# EAGLE design bt4.0_shield (EAGLE 6.1)
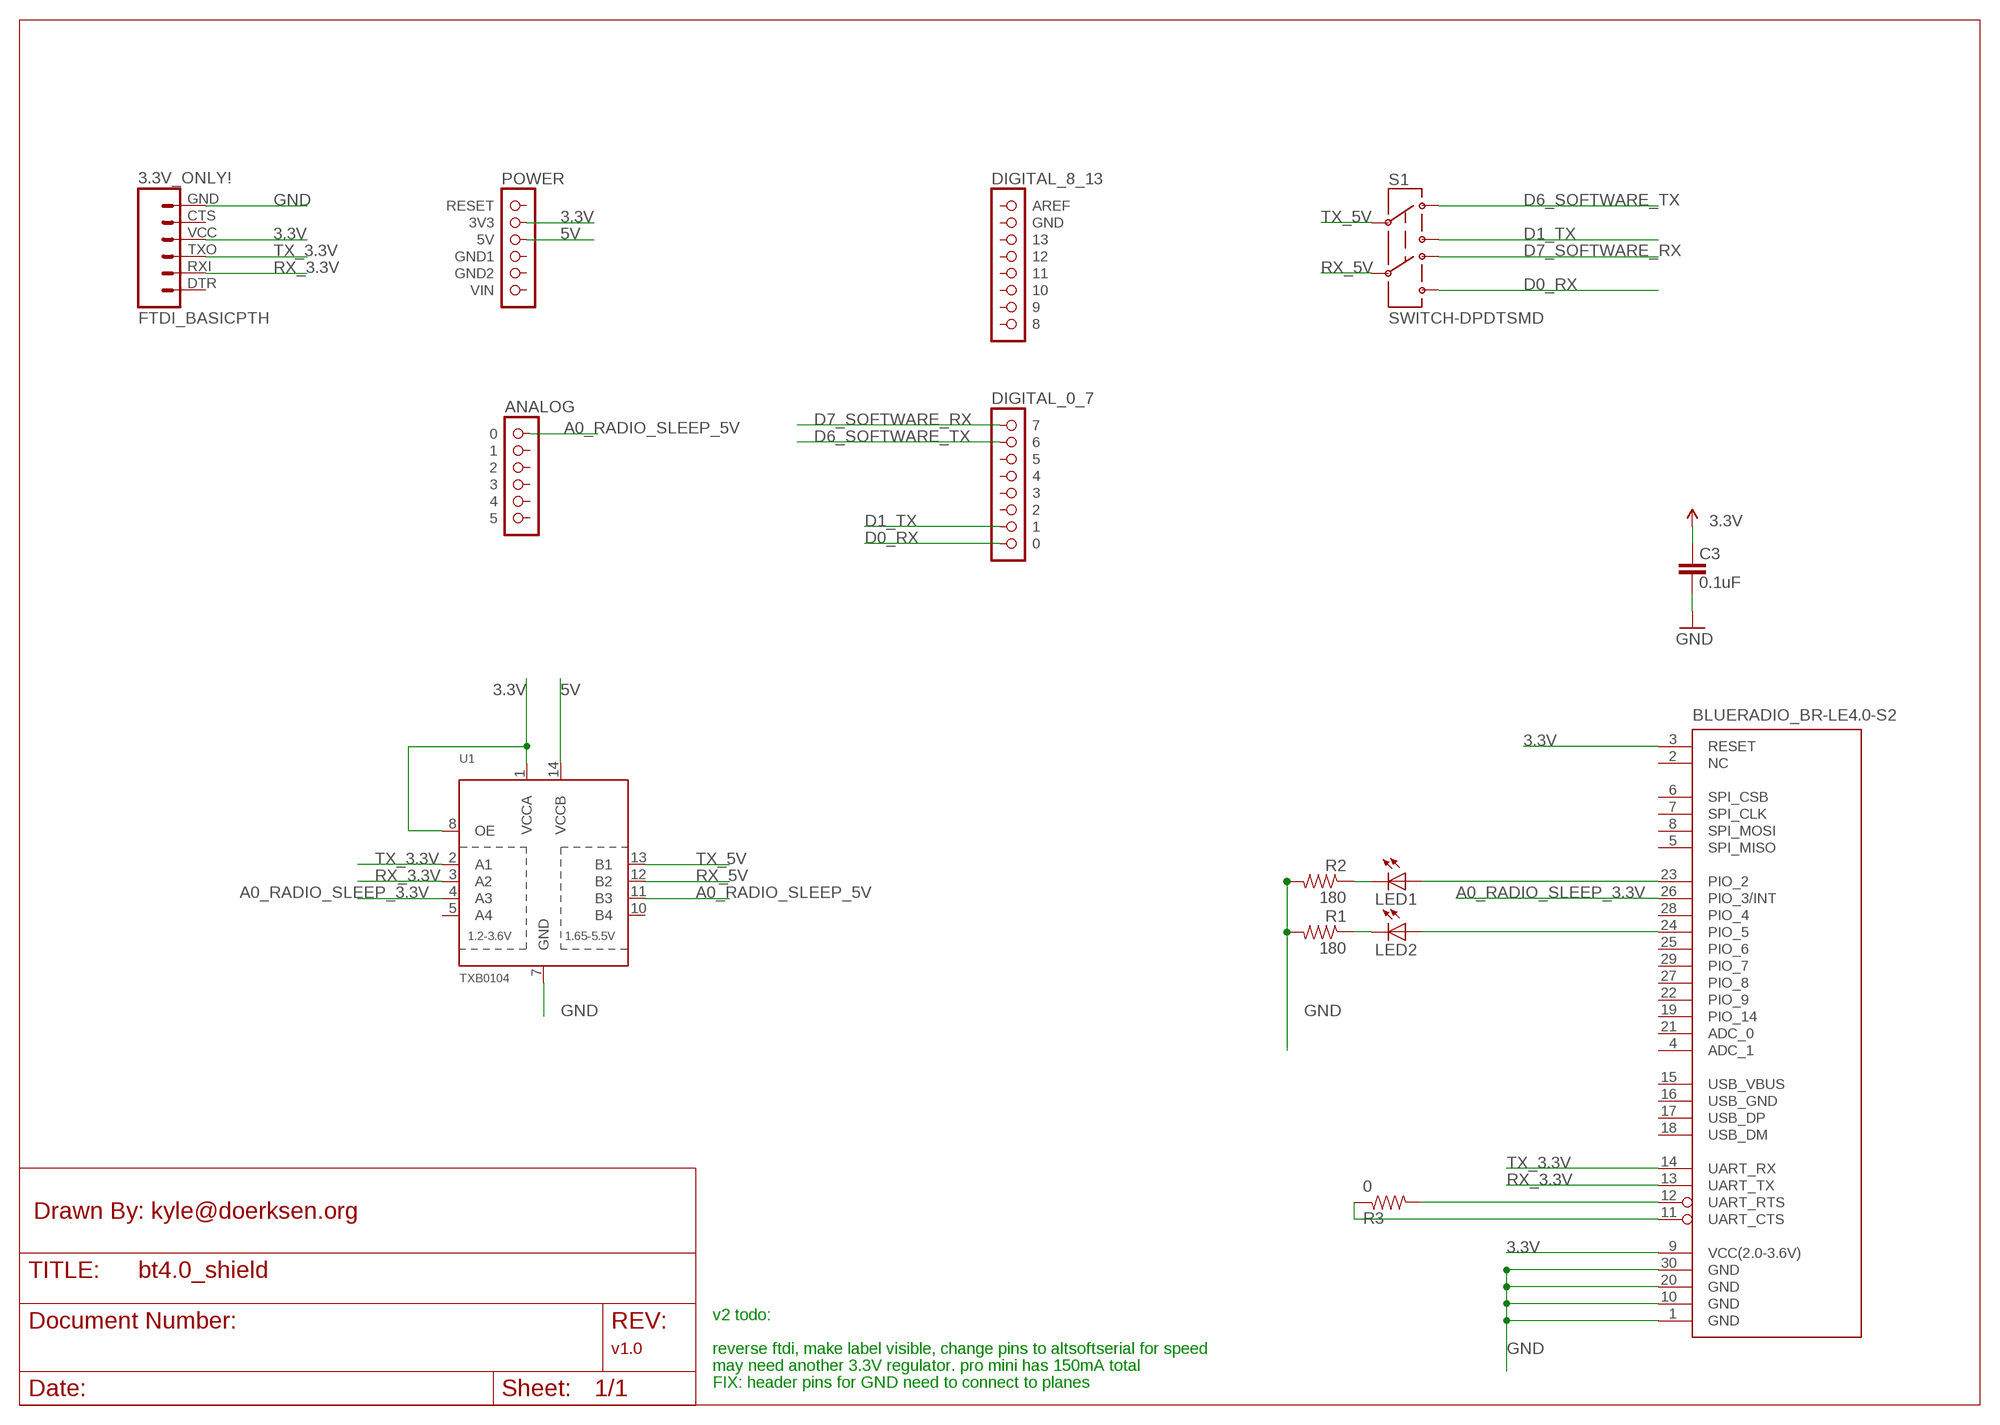
[diagram p0: schematic, sheet 1]

## Parts
3.3V_ONLY!  FTDI_BASICPTH  [FTDI_BASIC]
BLUERADIO_BR-LE4.0-S2  BLUERADIO_BR-LE4.0-S2  [BLUERADIO_BR-LE4.0-S2]
C3  0.1uF  CAP0402-CAP  [0402-CAP]
LED1  LED0603  [LED-0603]
LED2  LED0603  [LED-0603]
R1  180  RESISTOR0402-RES  [0402-RES]
R2  180  RESISTOR0402-RES  [0402-RES]
R3  0  RESISTOR0402-RES  [0402-RES]
S1  SWITCH-DPDTSMD  [AYZ0202]
U1  TXB0104  TXB0104PWRSOIC14  [SO14]
U$1  POWER  [1X06]
U$2  ANALOG  [1X06]
U$3  DIGITAL_0_7  [1X08]
U$4  DIGITAL_8_13  [1X08]

## Nets
3.3V: 3.3V_ONLY!.VCC BLUERADIO_BR-LE4.0-S2.3(RESET) BLUERADIO_BR-LE4.0-S2.9(VCC(2.0-3.6V)) C3.2 U1.1(VCCA) U1.8(OE) U$1.2(3V3) ; supply symbol labelled VCC
5V: U1.14(VCCB) U$1.3(5V)
A0_RADIO_SLEEP_3.3V: BLUERADIO_BR-LE4.0-S2.26(PIO_3/INT) U1.4(A3)
A0_RADIO_SLEEP_5V: U1.11(B3) U$2.1
D0_RX: S1.6 U$3.8
D1_TX: S1.3 U$3.7
D6_SOFTWARE_TX: S1.1 U$3.2
D7_SOFTWARE_RX: S1.4 U$3.1
GND [vcc]: 3.3V_ONLY!.GND BLUERADIO_BR-LE4.0-S2.1(GND) BLUERADIO_BR-LE4.0-S2.10(GND) BLUERADIO_BR-LE4.0-S2.20(GND) BLUERADIO_BR-LE4.0-S2.30(GND) C3.1 R1.2 R2.2 U1.7(GND)
N$1: BLUERADIO_BR-LE4.0-S2.24(PIO_5) LED2.A
N$2: LED1.C R2.1
N$3: BLUERADIO_BR-LE4.0-S2.23(PIO_2) LED1.A
N$4: LED2.C R1.1
N$5: BLUERADIO_BR-LE4.0-S2.12(UART_RTS) R3.2
N$9: BLUERADIO_BR-LE4.0-S2.11(UART_CTS) R3.1
RX_3.3V: 3.3V_ONLY!.RXI BLUERADIO_BR-LE4.0-S2.13(UART_TX) U1.3(A2)
RX_5V: S1.5 U1.12(B2)
TX_3.3V: 3.3V_ONLY!.TXO BLUERADIO_BR-LE4.0-S2.14(UART_RX) U1.2(A1)
TX_5V: S1.2 U1.13(B1)
Unconnected: 3.3V_ONLY!.CTS 3.3V_ONLY!.DTR BLUERADIO_BR-LE4.0-S2.2(NC) BLUERADIO_BR-LE4.0-S2.4(ADC_1) BLUERADIO_BR-LE4.0-S2.5(SPI_MISO) BLUERADIO_BR-LE4.0-S2.6(SPI_CSB) BLUERADIO_BR-LE4.0-S2.7(SPI_CLK) BLUERADIO_BR-LE4.0-S2.8(SPI_MOSI) BLUERADIO_BR-LE4.0-S2.15(USB_VBUS) BLUERADIO_BR-LE4.0-S2.16(USB_GND) BLUERADIO_BR-LE4.0-S2.17(USB_DP) BLUERADIO_BR-LE4.0-S2.18(USB_DM) BLUERADIO_BR-LE4.0-S2.19(PIO_14) BLUERADIO_BR-LE4.0-S2.21(ADC_0) BLUERADIO_BR-LE4.0-S2.22(PIO_9) BLUERADIO_BR-LE4.0-S2.25(PIO_6) BLUERADIO_BR-LE4.0-S2.27(PIO_8) BLUERADIO_BR-LE4.0-S2.28(PIO_4) BLUERADIO_BR-LE4.0-S2.29(PIO_7) U1.5(A4) U1.10(B4) U$1.1(RESET) U$1.4(GND1) U$1.5(GND2) U$1.6(VIN) U$2.2 U$2.3 U$2.4 U$2.5 U$2.6 U$3.3 U$3.4 U$3.5 U$3.6 U$4.1(AREF) U$4.2(GND) U$4.3 U$4.4 U$4.5 U$4.6 U$4.7 U$4.8

## Notes on the sheet
- Drawn By: kyle@doerksen.org
- v2 todo:
- v1.0 | reverse ftdi, make label visible, change pins to altsoftserial for speed
- may need another 3.3V regulator. pro mini has 150mA total
- FIX: header pins for GND need to connect to planes

## Library data of the parts
3.3V_ONLY! = SparkFun-Connectors:FTDI_BASIC: FTDI Basic header with labels
BLUERADIO_BR-LE4.0-S2 = SparkFun-RF:BLUERADIO_BR-LE4.0-S2
C3 = SparkFun:CAP: Capacitor Standard 0603 ceramic capacitor, and 0.1" leaded capacitor.
LED1 LED2 = SparkFun-LED:LED: LEDs Standard schematic elements and footprints for 5mm, 3mm, 1206, and 0603 sized LEDs. 5mm - Spark Fun Electronics SKU : COM-00529 (and others)
R1-R3 = SparkFun-Passives:RESISTOR: Resistor Basic schematic elements and footprints for 0603, 1206, and PTH resistors.
S1 = SparkFun-Electromechanical:SWITCH-DPDT: DPDT Version of the COM-00597
U1 = adafruit-2012:TXB0104PWR: 4-Bit Bi-Directional Level Shifter 1.2V-3.6V (VCCA) to 1.65V-5.5V (VCCB) bi-directional level shifter with auto direction sensing. Max data rate - VCCA 1.8V: 20Mbps (50ns), VCCA 3.3V: 100Mbps (10ns) Digikey: 296-21929-1-ND
U$1 = arduino:POWER
U$2 = arduino:ANALOG
U$3 = arduino:DIGITAL_0_7
U$4 = arduino:DIGITAL_8_13

## Net classes
1 vcc: width 0.254 mm

## Board
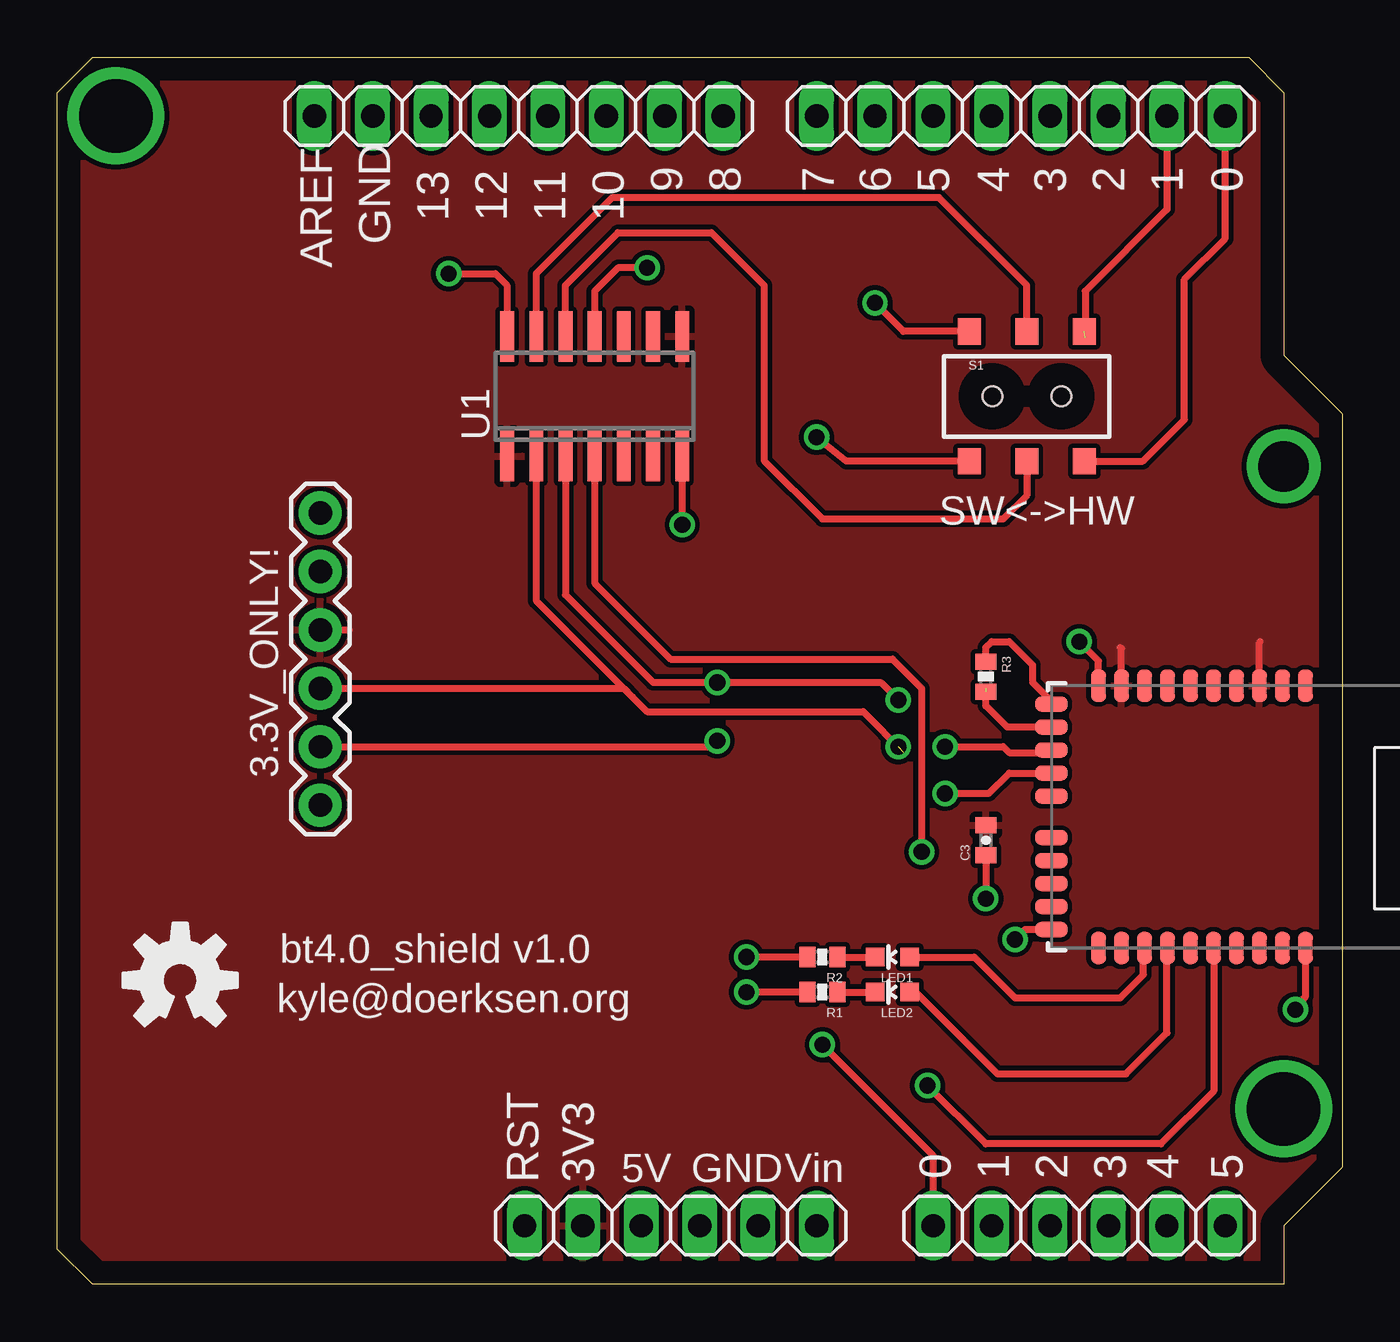
[diagram p1: board, top side]
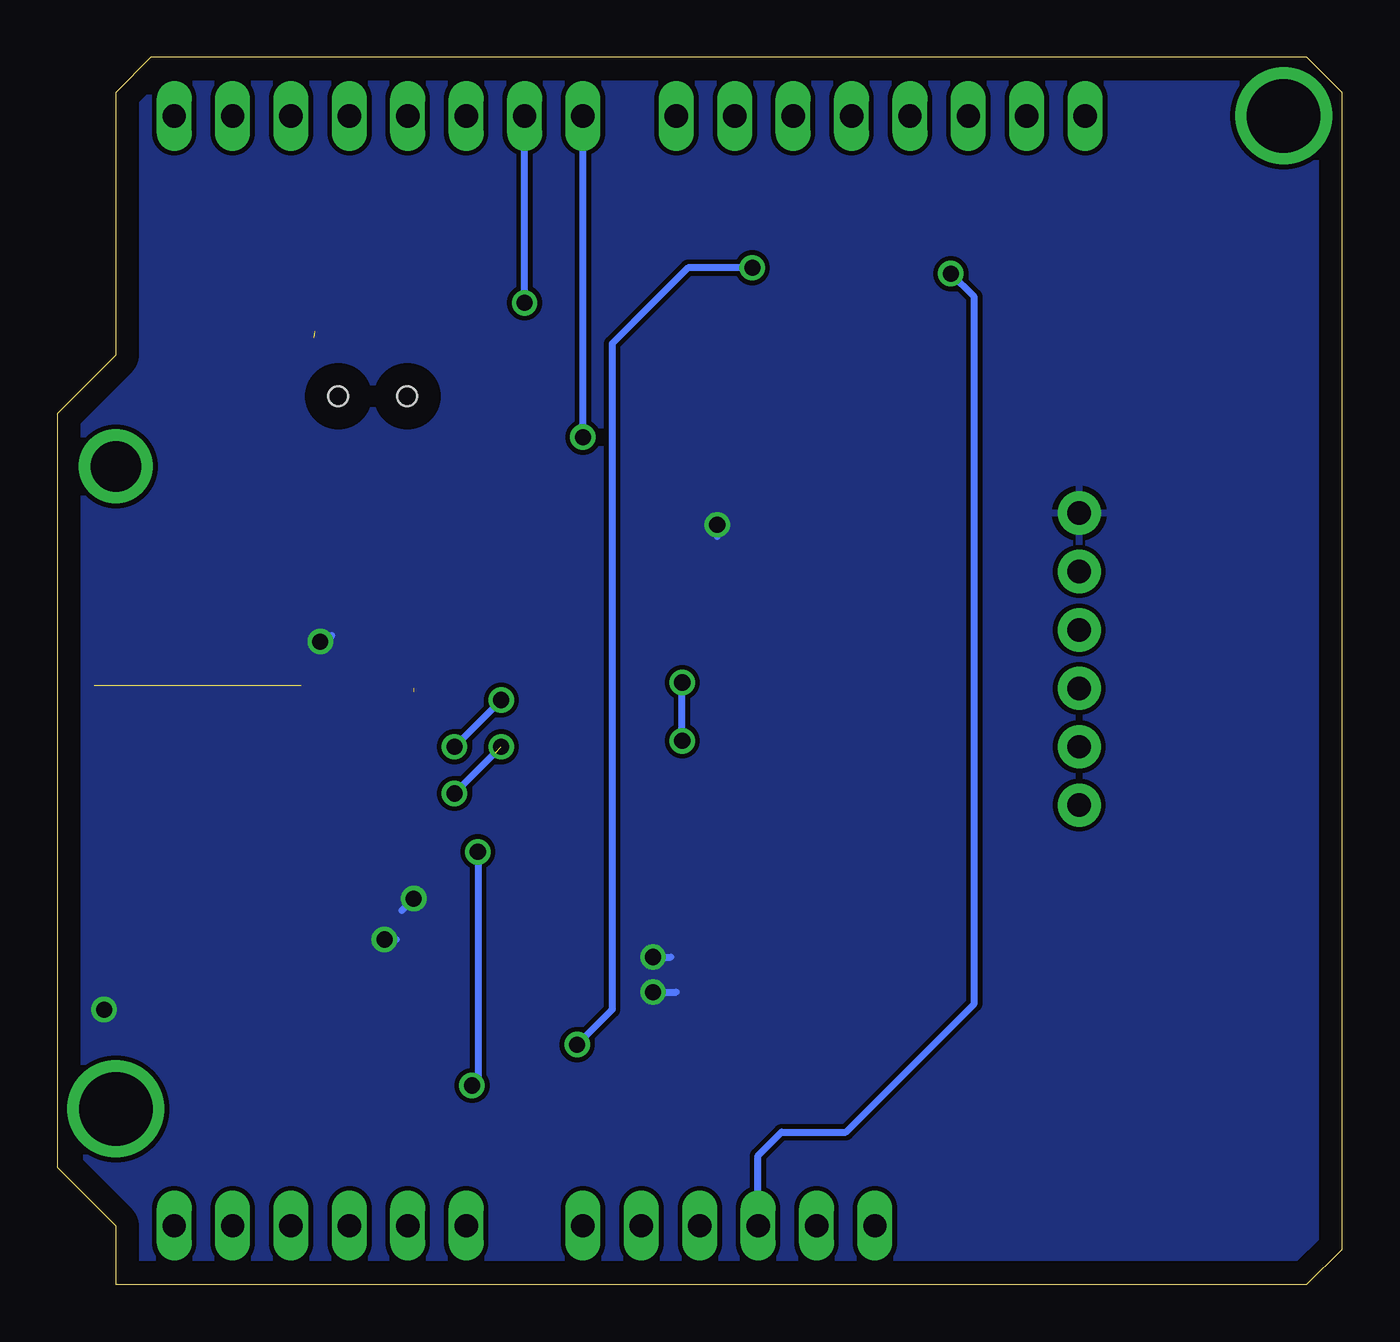
[diagram p2: board, bottom side, seen from below]

Size 55.88 x 53.34 mm. Coordinates in mm from the lower left corner, seen from the top.
Outline: 0,51.82 1.52,53.34 51.82,53.34 53.34,51.82 53.34,40.39 55.88,37.85 55.88,5.08 53.34,2.54 53.34,0 1.52,0 0,1.52 0,51.82
Copper layers (1*16): Top 0.035mm / dielectric 1.5mm / Bottom 0.035mm
Design rules: minimum track width 10mil, minimum drill 24mil, track to track 8mil, track to pad 8mil, pad to pad 8mil, via to via 8mil, smd to smd 8mil, copper to edge 40mil, drill to drill 8mil, minimum pad ring 10mil, minimum via ring 8mil, stop-mask expansion 4mil, vias tented up to drill 0mil, thermal gap 10mil

### Footprints (pad centres in the part's own frame; a part is rotated, then mirrored left to right if it is on the bottom)
FTDI_BASIC = drill 1.016 pad 1.88: CTS 10.16,0; DTR 0,0; GND 12.7,0; RXI 2.54,0; TXO 5.08,0; VCC 7.62,0
BLUERADIO_BR-LE4.0-S2 = smd 0.65 x 1.4: 1 -4.5,-5.7; 2 -3.5,-5.7; 3 -2.5,-5.7; 4 -1.5,-5.7; 5 -0.5,-5.7; 6 0.5,-5.7; 7 1.5,-5.7; 8 2.5,-5.7; 9 3.5,-5.7; 10 4.5,-5.7; 21 4.5,5.7; 22 3.5,5.7; 23 2.5,5.7; 24 1.5,5.7; 25 0.5,5.7; 26 -0.5,5.7; 27 -1.5,5.7; 28 -2.5,5.7; 29 -3.5,5.7; 30 -4.5,5.7 | smd 1.4 x 0.65: 11 6.55,-4.9; 12 6.55,-3.9; 13 6.55,-2.9; 14 6.55,-1.9; 15 6.55,-0.9; 16 6.55,0.9; 17 6.55,1.9; 18 6.55,2.9; 19 6.55,3.9; 20 6.55,4.9
0402-CAP = smd 0.7 x 0.9: 1 -0.65,0; 2 0.65,0
LED-0603 = smd 0.8 x 0.8: A 0,-0.75; C 0,0.75
0402-RES = smd 0.7 x 0.9: 1 -0.65,0; 2 0.65,0
AYZ0202 = smd 1 x 1.15: 1 -2.5,2.825; 2 0,2.825; 3 2.5,2.825; 4 -2.5,-2.825; 5 0,-2.825; 6 2.5,-2.825 | hole 0.85: 1.5,0; -1.5,0
SO14 = smd 0.6 x 2.2: 1 -3.81,-2.6; 2 -2.54,-2.6; 3 -1.27,-2.6; 4 0,-2.6; 5 1.27,-2.6; 6 2.54,-2.6; 7 3.81,-2.6; 8 3.81,2.6; 9 2.54,2.6; 10 1.27,2.6; 11 0,2.6; 12 -1.27,2.6; 13 -2.54,2.6; 14 -3.81,2.6
1X06 = drill 1.016 long: 1 -6.35,0; 2 -3.81,0; 3 -1.27,0; 4 1.27,0; 5 3.81,0; 6 6.35,0
1X08 = drill 1.016 long: 1 -8.89,0; 2 -6.35,0; 3 -3.81,0; 4 -1.27,0; 5 1.27,0; 6 3.81,0; 7 6.35,0; 8 8.89,0

### Placement (x,y rotation side)
3.3V_ONLY!  11.43,20.83 90 top
BLUERADIO_BR-LE4.0-S2  49.78,20.32 180 top
C3  40.39,19.3 90 top
LED1  36.32,14.22 90 top
LED2  36.32,12.7 90 top
R1  33.27,12.7 180 top
R2  33.27,14.22 180 top
R3  40.39,26.42 270 top
S1  42.16,38.61 0 top
U1  23.37,38.61 0 top
U$1  26.67,2.54 0 top
U$2  44.45,2.54 0 top
U$3  41.91,50.8 0 top
U$4  20.07,50.8 0 top
U$7  [OSHW-LOGO-M]  5.33,13.21 0 top

### Tracks (layer width: path | path; a pad name or v marks a point on that pad's centre or on a via)
3.3V
  Top 0.305: 3.3V_ONLY!.VCC 12.7,28.45 | BLUERADIO_BR-LE4.0-S2.9 46.28,27.63 46.23,27.69 | BLUERADIO_BR-LE4.0-S2.3 52.28,27.9 52.32,27.94
  pour Top: 0,56.13 -0.25,56.13 -0.25,-7.87 71.63,-7.87 71.63,54.86 1.02,54.86 1.02,56.13
5V  (via drill 0.7)
  Top 0.305: v17.02,43.94 19.05,43.94 19.56,43.43 U1.14
  Bottom 0.305: U$1.3 25.4,5.59 24.38,6.6 21.59,6.6 16,12.19 16,42.93 v17.02,43.94
A0_RADIO_SLEEP_3.3V  (via drill 0.7)
  Top 0.305: U1.4 23.37,30.48 26.67,27.18 36.32,27.18 37.59,25.91 v37.59,18.8 | BLUERADIO_BR-LE4.0-S2.26 50.29,14.61 50.29,8.38 48.01,6.1 40.39,6.1 v37.85,8.64
  Bottom 0.305: v37.59,18.8 37.59,8.89 v37.85,8.64
A0_RADIO_SLEEP_5V  (via drill 0.7)
  Top 0.305: U$2.1 38.1,5.59 v33.27,10.41 | v25.65,44.2 24.38,44.2 23.37,43.18 U1.11
  Bottom 0.305: v25.65,44.2 28.45,44.2 31.75,40.89 31.75,11.94 v33.27,10.41
D0_RX
  Top 0.305: S1.6 47.21,35.78 49.02,37.59 49.02,43.69 50.8,45.47 U$3.8
D1_TX  (1 unrouted)
  Top 0.305: U$3.7 48.26,46.74 44.7,43.18 44.7,41.15
D6_SOFTWARE_TX  (via drill 0.7)
  Top 0.305: S1.1 36.8,41.43 v35.56,42.67
  Bottom 0.305: v35.56,42.67 U$3.2
D7_SOFTWARE_RX  (via drill 0.7)
  Top 0.305: S1.4 34.32,35.78 v33.02,36.83
  Bottom 0.305: v33.02,36.83 U$3.1
GND  (via drill 0.7)  (1 unrouted)
  Top 0.305: C3.1 v40.39,16.76 | BLUERADIO_BR-LE4.0-S2.20 42.09,15.42 v41.66,14.99 | BLUERADIO_BR-LE4.0-S2.30 54.28,12.52 v53.85,11.94 | R2.2 v29.97,14.22 | R1.2 v29.97,12.7 | U1.7 27.18,33.53 v27.18,33.02 | BLUERADIO_BR-LE4.0-S2.10 45.28,27.11 v44.45,27.94
  Bottom 0.305: v40.39,16.76 40.89,16.26 | v41.66,14.99 41.15,14.99 | v53.85,11.94 53.59,12.19 | v29.97,14.22 29.21,14.22 | v29.97,12.7 28.96,12.7 | v27.18,33.02 27.18,32.51 | v44.45,27.94 44.2,27.94 43.94,28.19
  pour Bottom: -1.52,58.42 74.42,58.42 74.42,-10.41 -1.52,-10.41
N$1
  Top 0.305: LED2.A 37.34,12.7 40.89,9.14 46.48,9.14 48.26,10.92 48.26,14.6 BLUERADIO_BR-LE4.0-S2.24
N$2
  Top 0.305: R2.1 LED1.C
N$3
  Top 0.305: LED1.A 39.88,14.22 41.66,12.45 46.23,12.45 47.24,13.46 47.24,14.58 BLUERADIO_BR-LE4.0-S2.23
N$4
  Top 0.305: R1.1 LED2.C
N$5  (1 unrouted)
  Top 0.305: BLUERADIO_BR-LE4.0-S2.12 41.31,24.22 40.39,25.15 40.39,25.91
N$6  (via drill 3.2)
  other vias: 2.54,50.8
N$7  (via drill 3.2)
  other vias: 53.34,7.62
N$8  (via drill 2.2)
  other vias: 53.34,35.56
N$9
  Top 0.305: BLUERADIO_BR-LE4.0-S2.11 43.23,25.35 42.93,25.65 42.42,26.16 42.42,26.92 41.4,27.94 40.64,27.94 40.39,27.69 R3.1
RX_3.3V  (via drill 0.7)
  Top 0.305: U1.3 22.1,29.97 25.91,26.16 v28.7,26.16 | v28.7,26.16 30.23,26.16 | 3.3V_ONLY!.RXI 28.45,23.37 v28.7,23.62 | v38.61,23.37 41.15,23.37 41.4,23.11 43.13,23.11 BLUERADIO_BR-LE4.0-S2.13 | 35.81,26.16 v36.58,25.4 35.81,26.16 | v28.7,26.16 35.81,26.16
  Bottom 0.305: v36.58,25.4 v38.61,23.37 | v28.7,23.62 28.7,25.65 v28.7,26.16
RX_5V
  Top 0.305: S1.5 42.16,34.29 41.15,33.27 33.27,33.27 30.73,35.81 30.73,43.43 28.45,45.72 24.38,45.72 22.1,43.43 U1.12
TX_3.3V  (via drill 0.7)  (1 unrouted)
  Top 0.305: U1.2 20.83,29.72 25.02,25.53 | 25.02,25.53 25.65,24.89 35.05,24.89 36.83,23.11 | 43.11,22.1 BLUERADIO_BR-LE4.0-S2.14 41.4,22.23 40.51,21.34 v38.61,21.34 | 3.3V_ONLY!.TXO 24.64,25.91 25.02,25.53
  Bottom 0.305: v36.58,23.37 v38.61,21.34
TX_5V
  Top 0.305: S1.2 42.16,43.43 38.35,47.24 24.13,47.24 20.83,43.94 U1.13

### Text on the board
tPlace: SW<->HW | bt4.0_shield v1.0 | kyle@doerksen.org
tNames: 9 | 8 | 7 | 6 | 5 | 4 | 3 | 2 | 1 | 0 | 13 | 12 | 11 | 10 | GND | AREF | 0 | 1 | 2 | 3 | 4 | 5 | RST | 3V3 | 5V | GND | Vin
TallParts: USB | ISP | PWR
ArduinoHoles: 3.2mm | 2.2mm | 3.2mm